# Altium project EE-3951W-Proj.PrjPcb
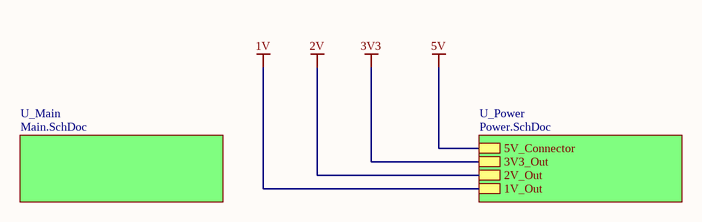
[diagram p0: Master.SchDoc]
3 sheets, 35 parts. Net scope: hierarchical (ports join the sheet entries above them; power ports are global).
Board file: PCB1.PcbDoc
Sheets:
  Master.SchDoc
    U_Main = Main.SchDoc
    U_Power = Power.SchDoc

## Sheet Master.SchDoc
size A; SheetNumber: 1; SheetTotal: 3

### Sub-sheets
U_Main = Main.SchDoc: no entries
U_Power = Power.SchDoc: 5V_Connector, 3V3_Out, 2V_Out, 1V_Out

## Sheet Main.SchDoc
size A; SheetNumber: 3; SheetTotal: 3
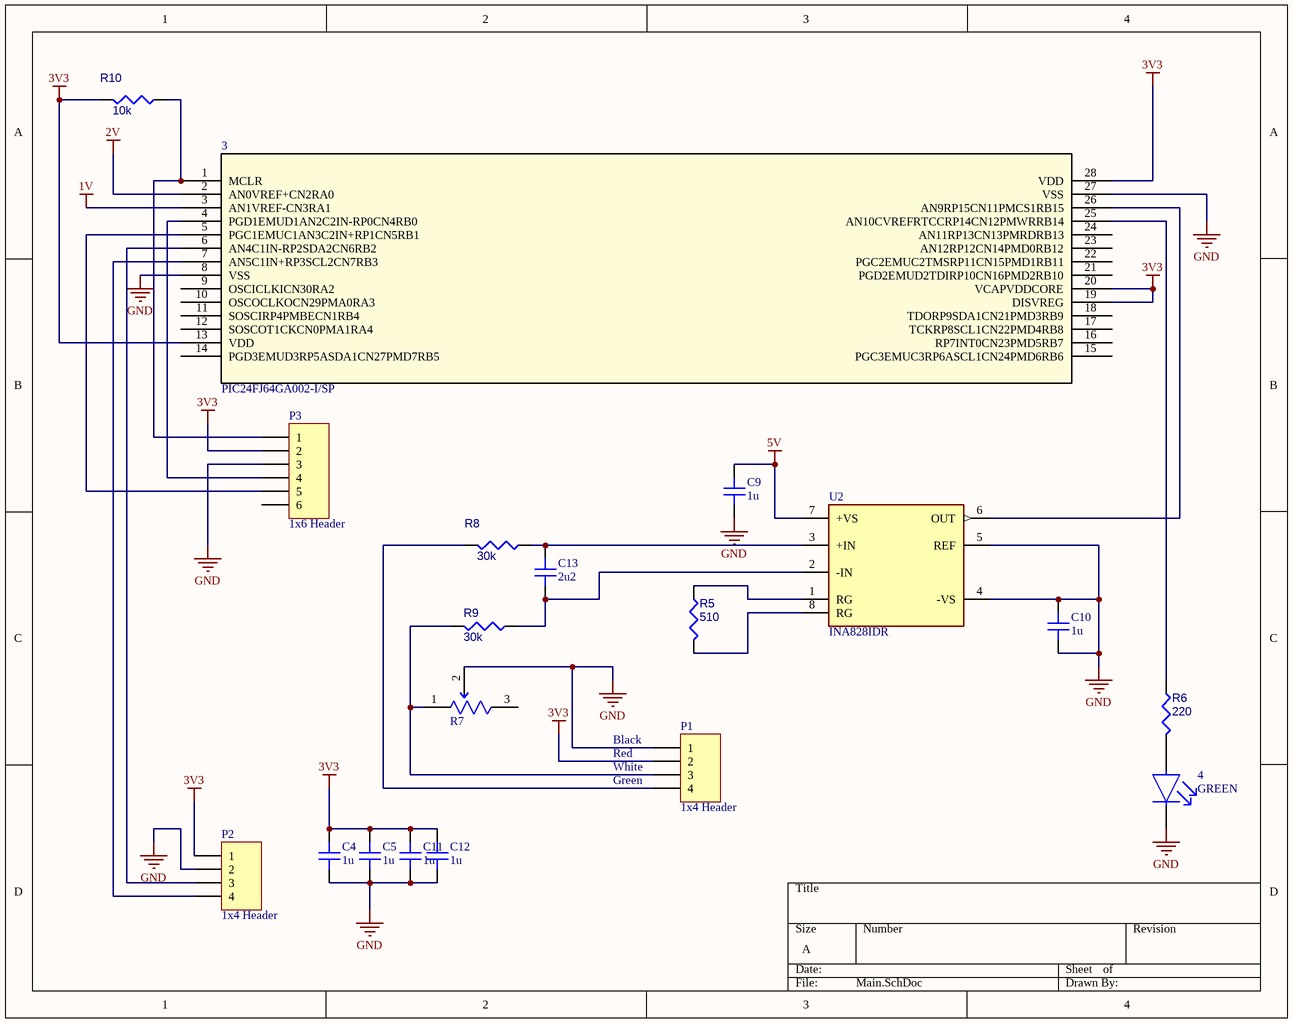
[diagram p1: Main.SchDoc]

### Parts
3  PIC24FJ64GA002-I/SP  [DIP787W46P254L3467H508Q28]
4  GREEN  [FP-ASMT-RF45-AN002-MFG]
C4  value 1u  [CAP 0603_1608]
C5  value 1u  [CAP 0603_1608]
C9  value 1u  [CAP 0603_1608]
C10  value 1u  [CAP 0603_1608]
C11  value 1u  [CAP 0603_1608]
C12  value 1u  [CAP 0603_1608]
C13  value 2u2  [CAP 0603_1608]
P1  1x4 Header  [1x4 Header]
P2  1x4 Header  [1x4 Header]
P3  1x6 Header  [1x6 Header]
R5  510  [RESC1608X55X25ML10T15]
R6  220  [RESC1608X55X25ML10T15]
R7  PV36W501C01B00  [FP-PV36W-MFG]  (value not drawn)
R8  30k  [RESC1608X55X25ML10T15]
R9  30k  [RESC1608X55X25ML10T15]
R10  10k  [RESC1608X55X25ML10T15]
U2  INA828IDR  [FP-D0008A-IPC_B]

### Nets
1V: 3.3(AN1VREF-CN3RA1)  [project net 1V_Out]
2V: 3.2(AN0VREF+CN2RA0)  [project net 2V_Out]
3V3: 3.13(VDD) 3.19(DISVREG) 3.20(VCAPVDDCORE) 3.28(VDD) C4.2 C5.2 C11.2 C12.2 P1.2 P2.1 P3.2 R10.2  [project net 3V3_Out]
5V: C9.2 U2.7(+VS)  [project net 5V_Connector]
GND: 3.8(VSS) 3.27(VSS) 4.1(C) C4.1 C5.1 C9.1 C10.1 C10.2 C11.1 C12.1 P1.1 P2.2 P3.3 R7.2 U2.4(-VS) U2.5(REF)
Net3_1: 3.1(MCLR) P3.1 R10.1
Net3_4: 3.4(PGD1EMUD1AN2C2IN-RP0CN4RB0) P3.4
Net3_5: 3.5(PGC1EMUC1AN3C2IN+RP1CN5RB1) P3.5
Net3_6: 3.6(AN4C1IN-RP2SDA2CN6RB2) P2.3
Net3_7: 3.7(AN5C1IN+RP3SCL2CN7RB3) P2.4
Net3_25: 3.25(AN10CVREFRTCCRP14CN12PMWRRB14) R6.1
Net3_26: 3.26(AN9RP15CN11PMCS1RB15) U2.6(OUT)
Net4_2: 4.2(A) R6.2
NetC13_1: C13.1 R9.1 U2.2(-IN)
NetC13_2: C13.2 R8.1 U2.3(+IN)
NetP1_3: P1.3 R7.1 R9.2
NetP1_4: P1.4 R8.2
NetR5_1: R5.1 U2.1(RG)
NetR5_2: R5.2 U2.8(RG)

Not connected (* = marked no-connect by the designer): 3 9(OSCICLKICN30RA2) 10(OSCOCLKOCN29PMA0RA3) 11(SOSCIRP4PMBECN1RB4) 12(SOSCOT1CKCN0PMA1RA4) 14(PGD3EMUD3RP5ASDA1CN27PMD7RB5) 15(PGC3EMUC3RP6ASCL1CN24PMD6RB6) 16(RP7INT0CN23PMD5RB7) 17(TCKRP8SCL1CN22PMD4RB8) 18(TDORP9SDA1CN21PMD3RB9) 21(PGD2EMUD2TDIRP10CN16PMD2RB10) 22(PGC2EMUC2TMSRP11CN15PMD1RB11) 23(AN12RP12CN14PMD0RB12) 24(AN11RP13CN13PMRDRB13); P3 6; R7 3

### Notes on the sheet
- (near P1) Black
- (near P1) Red
- (near P1) White
- (near P1) Green

### Library data of the parts
3 = CMP-031-00017-2: PIC PICÂ® 24F Microcontroller IC 16-Bit 32MHz 64KB _22K x 24_ FLASH 28-SPDIP; MF: Microchip; Availability: Unavailable; Design Item ID: PIC24FJ64GA002-I/SP; Value: *; Pins: 28; SnapEDA_Link: https://www.snapeda.com/parts/PIC24FJ64GA002-I/SP/Microchip/view-part/262458/?ref=snap; Case/Package: SPDIP-28 Microchip; Source: SnapEDAsch.SchLib; MP: PIC24FJ64GA002-I/SP; Price: None; Component Type: Standard
4 = CMP-2000-05796-2: ASMT-RF45-AN002 LED YLW/GREEN DIFFUSED 0603 SMD; Manufacturer: Broadcom; Viewing Angle: 145°; Reverse Voltage: 5V; Luminous Intensity: 60mcd; Forward Voltage: 2V; Wavelength: 573nm; Forward Current: 20mA; Led Orientation: Top View; Max Junction Temp: +110°C; Peak Emmision Wavelength: 574nm; Power Dissipation: 48mW; RoHS: TRUE; Category: Diode; Height: 0.55mm; Package: ASMT-RF45-AN002; Device Class L1: Optoelectronics; Temperature: -40°C to +100°C; Colour: Yellow Green; ComponentLink2URL: https://docs.broadcom.com/docs/AV02-0378EN; Mouser Description: LED; SMD; 0603; yellow green; 28-60mcd; 1.6x0.8x0.45mm; 145°; 20mA; Temperature Range High: +100°C; Temperature Range Low: -40°C; Octopart: https://octopart.com/asmt-rf45-an002-broadcom-71127304; Lead Free: Yes; ComponentLink2Description: Datasheet; Device Class L2: LEDs; Manufacturer Part Number: ASMT-RF45-AN002; Digikey Description: LED YLW/GREEN DIFFUSED 0603 SMD; Automotive: No; Device Class L3: unset
C4 C5 C9-C13 = CMP-184-001772-1: Part Number: ZRB18AR6YA475ME05L; manufacturer: Murata Electronics; Capacitance: 4.7 µF; Tolerance: ±20%; Voltage - Rated: 35V; Temperature Coefficient: X5R; ComponentLink1URL: https://search.murata.co.jp/Ceramy/image/img/A01X/G101/ENG/ZRB18AR6YA475ME05-01.pdf; Package / Case: 0603 (1608 Metric); series: ZRB; Mounting Type: Surface Mount, MLCC; ComponentLink2Description: DigiKey Link; partid: 9721; Device Package: 0603 (1608 Metric); Lifecycle Status: Active; packaging: TapeAndReel; Applications: Acoustic Noise Reduction; Part Status: Active; Thickness (Max): 0.047" (1.20mm); lastupdated: 9/19/2022 1:00:59 PM; Operating Temperature: -55°C ~ 85°C; ComponentLink2URL: https://www.digikey.com/en/products/detail/murata-electronics/ZRB18AR6YA475ME05L/7595507; price: 0.10; ComponentLink1Description: Datasheet; Minimum Order: 1; Size / Dimension: 0.063" L x 0.031" W (1.60mm x 0.80mm); Features: Interposer Termination
P1 P2 = CMP-006-000008-2: Male Header, Dupont, 1x4; Source: 1x4 Header.SchLib; Design Item ID: 1x4 Header
P3 = CMP-010-000000-2: Male Header, Dupont, 1x6; Source: 1x6 Header.SchLib; Design Item ID: 1x6 Header
R5 R6 R8-R10 = CMP-009-00014-4: Chip Resistor, +/-1%, 0.1 W, -55 to 155 degC, 0603 (1608 Metric); Value: 10 kOhms; Power: 100mW; Tolerance: 1%; Voltage Rating: 50V; Max Operating Temperature: 155°C; Pins: 2; RoHS Compliant: True; Case/Package: 0603; Min Operating Temperature: -55°C; Mounting Technology: SM
R7 = CMP-009-00201-1: Trimmer; RoHS Compliant: Yes
U2 = CMP-00026-1: Instrumentation Amplifier, 1 Func, 90uV Offset-Max, 2MHz Band Width, PDSO8

## Sheet Power.SchDoc
size A; SheetNumber: 2; SheetTotal: 3
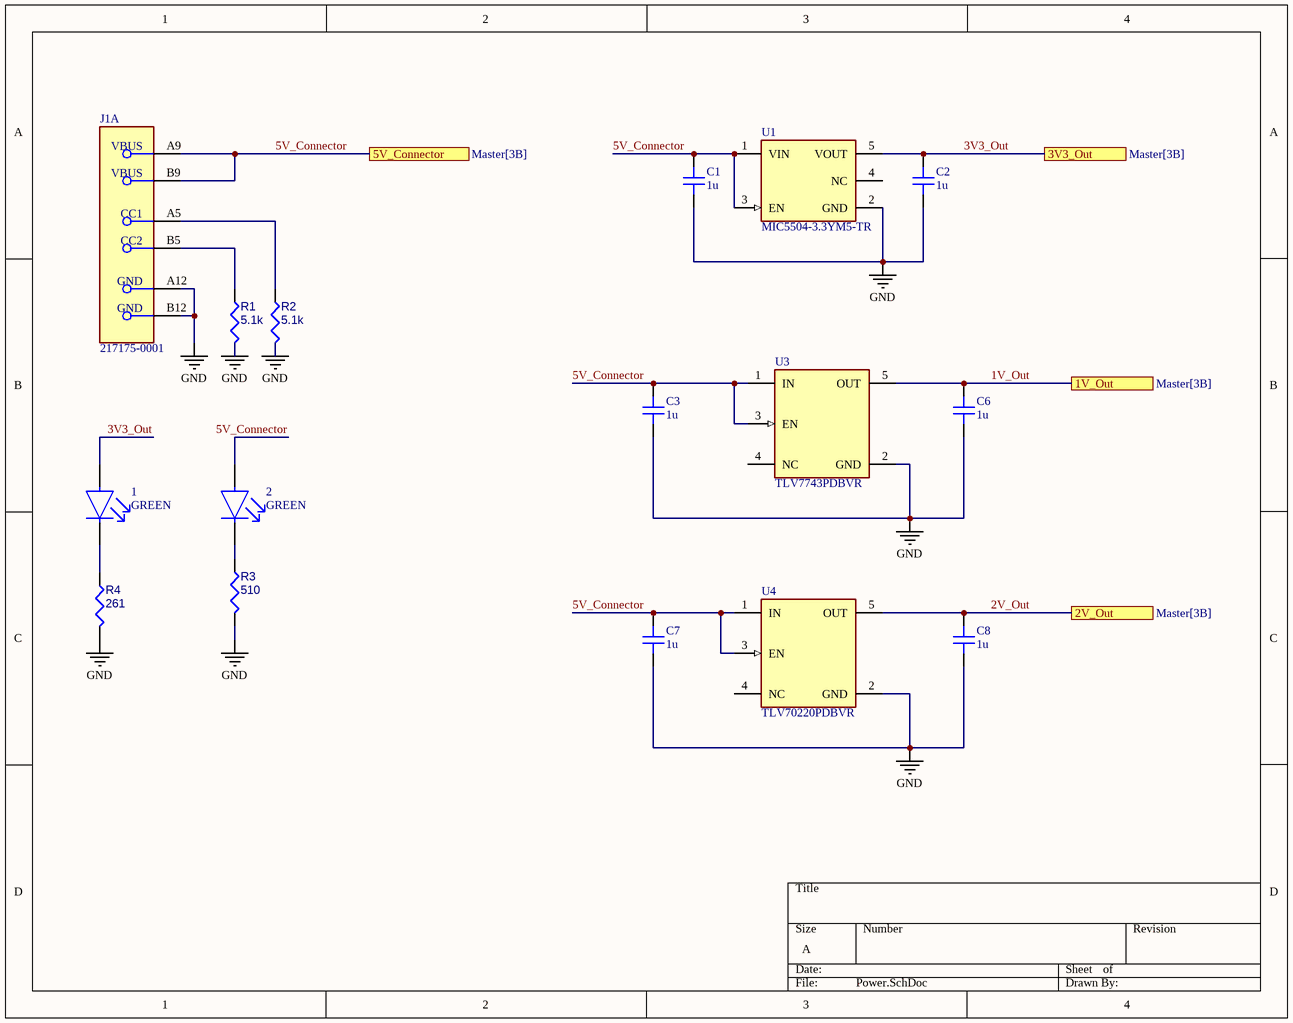
[diagram p2: Power.SchDoc]

### Parts
1  GREEN  [FP-ASMT-RF45-AN002-MFG]
2  GREEN  [FP-ASMT-RF45-AN002-MFG]
C1  value 1u  [CAP 0603_1608]
C2  value 1u  [CAP 0603_1608]
C3  value 1u  [CAP 0603_1608]
C6  value 1u  [CAP 0603_1608]
C7  value 1u  [CAP 0603_1608]
C8  value 1u  [CAP 0603_1608]
J1  217175-0001  [FP-217175-0001-MFG]  (part A of 2)
R1  5.1k  [RESC1608X55X25ML10T15]
R2  5.1k  [RESC1608X55X25ML10T15]
R3  510  [RESC1608X55X25ML10T15]
R4  261  [RESC1608X55X25ML10T15]
U1  MIC5504-3.3YM5-TR  [FP-SOT23-5LD-PL-1-IPC_B]
U3  TLV7743PDBVR  [FP-DBV0005A-IPC_C]
U4  TLV70220PDBVR  [FP-DBV0005A-IPC_C]

### Ports
1V_Out (see Master[3B]), 2V_Out (see Master[3B]), 3V3_Out (see Master[3B]), 5V_Connector (see Master[3B])

### Nets
1V_Out: C6.1 U3.5(OUT) ; port 1V_Out
2V_Out: C8.1 U4.5(OUT) ; port 2V_Out
3V3_Out: 1.2(A) C2.1 U1.5(VOUT) ; port 3V3_Out
5V_Connector: 2.2(A) C1.1 C3.1 C7.1 J1.A9(VBUS) J1.B9(VBUS) U1.1(VIN) U1.3(EN) U3.1(IN) U3.3(EN) U4.1(IN) U4.3(EN) ; port 5V_Connector
GND: C1.2 C2.2 C3.2 C6.2 C7.2 C8.2 J1.A12(GND) J1.B12(GND) R1.2 R2.2 R3.2 R4.2 U1.2(GND) U3.2(GND) U4.2(GND)
Net1_1: 1.1(C) R4.1
Net2_1: 2.1(C) R3.1
NetJ1_A5: J1.A5(CC1) R2.1
NetJ1_B5: J1.B5(CC2) R1.1

Not connected (* = marked no-connect by the designer): U1 4(NC); U3 4(NC); U4 4(NC)

### Library data of the parts
1 2 = CMP-2000-05796-2: as 4 on sheet Main; RoHS: TRUE; Category: Diode; Height: 0.55mm; Package: ASMT-RF45-AN002; Device Class L1: Optoelectronics; Temperature: -40°C to +100°C; Colour: Yellow Green; ComponentLink2URL: https://docs.broadcom.com/docs/AV02-0378EN; Mouser Description: LED; SMD; 0603; yellow green; 28-60mcd; 1.6x0.8x0.45mm; 145°; 20mA; Temperature Range High: +100°C; Temperature Range Low: -40°C; Octopart: https://octopart.com/asmt-rf45-an002-broadcom-71127304; Lead Free: Yes; ComponentLink2Description: Datasheet; Device Class L2: LEDs; Manufacturer Part Number: ASMT-RF45-AN002; Digikey Description: LED YLW/GREEN DIFFUSED 0603 SMD; Automotive: No; Device Class L3: unset
C1-C3 C6-C8 = CMP-184-001772-1: as C4 on sheet Main; ComponentLink1URL: https://search.murata.co.jp/Ceramy/image/img/A01X/G101/ENG/ZRB18AR6YA475ME05-01.pdf; Package / Case: 0603 (1608 Metric); series: ZRB; Mounting Type: Surface Mount, MLCC; ComponentLink2Description: DigiKey Link; partid: 9721; Device Package: 0603 (1608 Metric); Lifecycle Status: Active; packaging: TapeAndReel; Applications: Acoustic Noise Reduction; Part Status: Active; Thickness (Max): 0.047" (1.20mm); lastupdated: 9/19/2022 1:00:59 PM; Operating Temperature: -55°C ~ 85°C; ComponentLink2URL: https://www.digikey.com/en/products/detail/murata-electronics/ZRB18AR6YA475ME05L/7595507; price: 0.10; ComponentLink1Description: Datasheet; Minimum Order: 1; Size / Dimension: 0.063" L x 0.031" W (1.60mm x 0.80mm); Features: Interposer Termination
J1 = CMP-002-00112-1: Conn USB 2.0 Type C F 6 POS 1.23mm/1.02mm/1mm Solder RA SMD 6 Terminal 1 Port
R1-R4 = CMP-009-00014-4: as R5 on sheet Main; Max Operating Temperature: 155°C; Pins: 2; RoHS Compliant: True; Case/Package: 0603; Min Operating Temperature: -55°C; Mounting Technology: SM
U1 = CMP-008-00006-1: Fixed Positive LDO Regulator, 3.3V, 0.38V Dropout, CMOS, PDSO5; RoHS Compliant: Yes
U3 U4 = CMP-019-00061-1: Fixed Positive LDO Regulator, 2V, CMOS, PDSO5; Max Supply Voltage: 5.5V; RoHS Compliant: Yes; Case/Package: LSSOP; Pins: 5

## Nets that join several sheets
1V_Out: Main (3.3), Power (C6.1 U3.5)
2V_Out: Main (3.2), Power (C8.1 U4.5)
3V3_Out: Main (12 pins), Power (1.2 C2.1 U1.5)
5V_Connector: Main (C9.2 U2.7), Power (12 pins)
GND: Main (16 pins), Power (15 pins)